# Altium schematic sheet nrf-adafruit bno055.SchDoc: Adafruit nRF52840 Bluefruit Feather Express Rev E
size 409 x 281 mm; SheetTotal: 1; Origin: Eagle; SheetNumber: 1; YEAR: YEAR; COMPANY: COMPANY; DRAWN: DRAWN; Date: 7/7/2025 6:48:38 PM; REV: REV; GateName_1: G$1; SymbolName_1: FRAME_A3; LibraryName: microbuilder; DeviceSetName: FRAME_A3; GateName_2: G$3; SymbolName_2: FRAME_DOCFIELD; DRG: DRG; o: o; N: N; C: C; ISSUE: ISSUE; FILE: FILE:; PAGE: PAGE:; CHECKED: CHECKED; DRGNO: >DRGNO
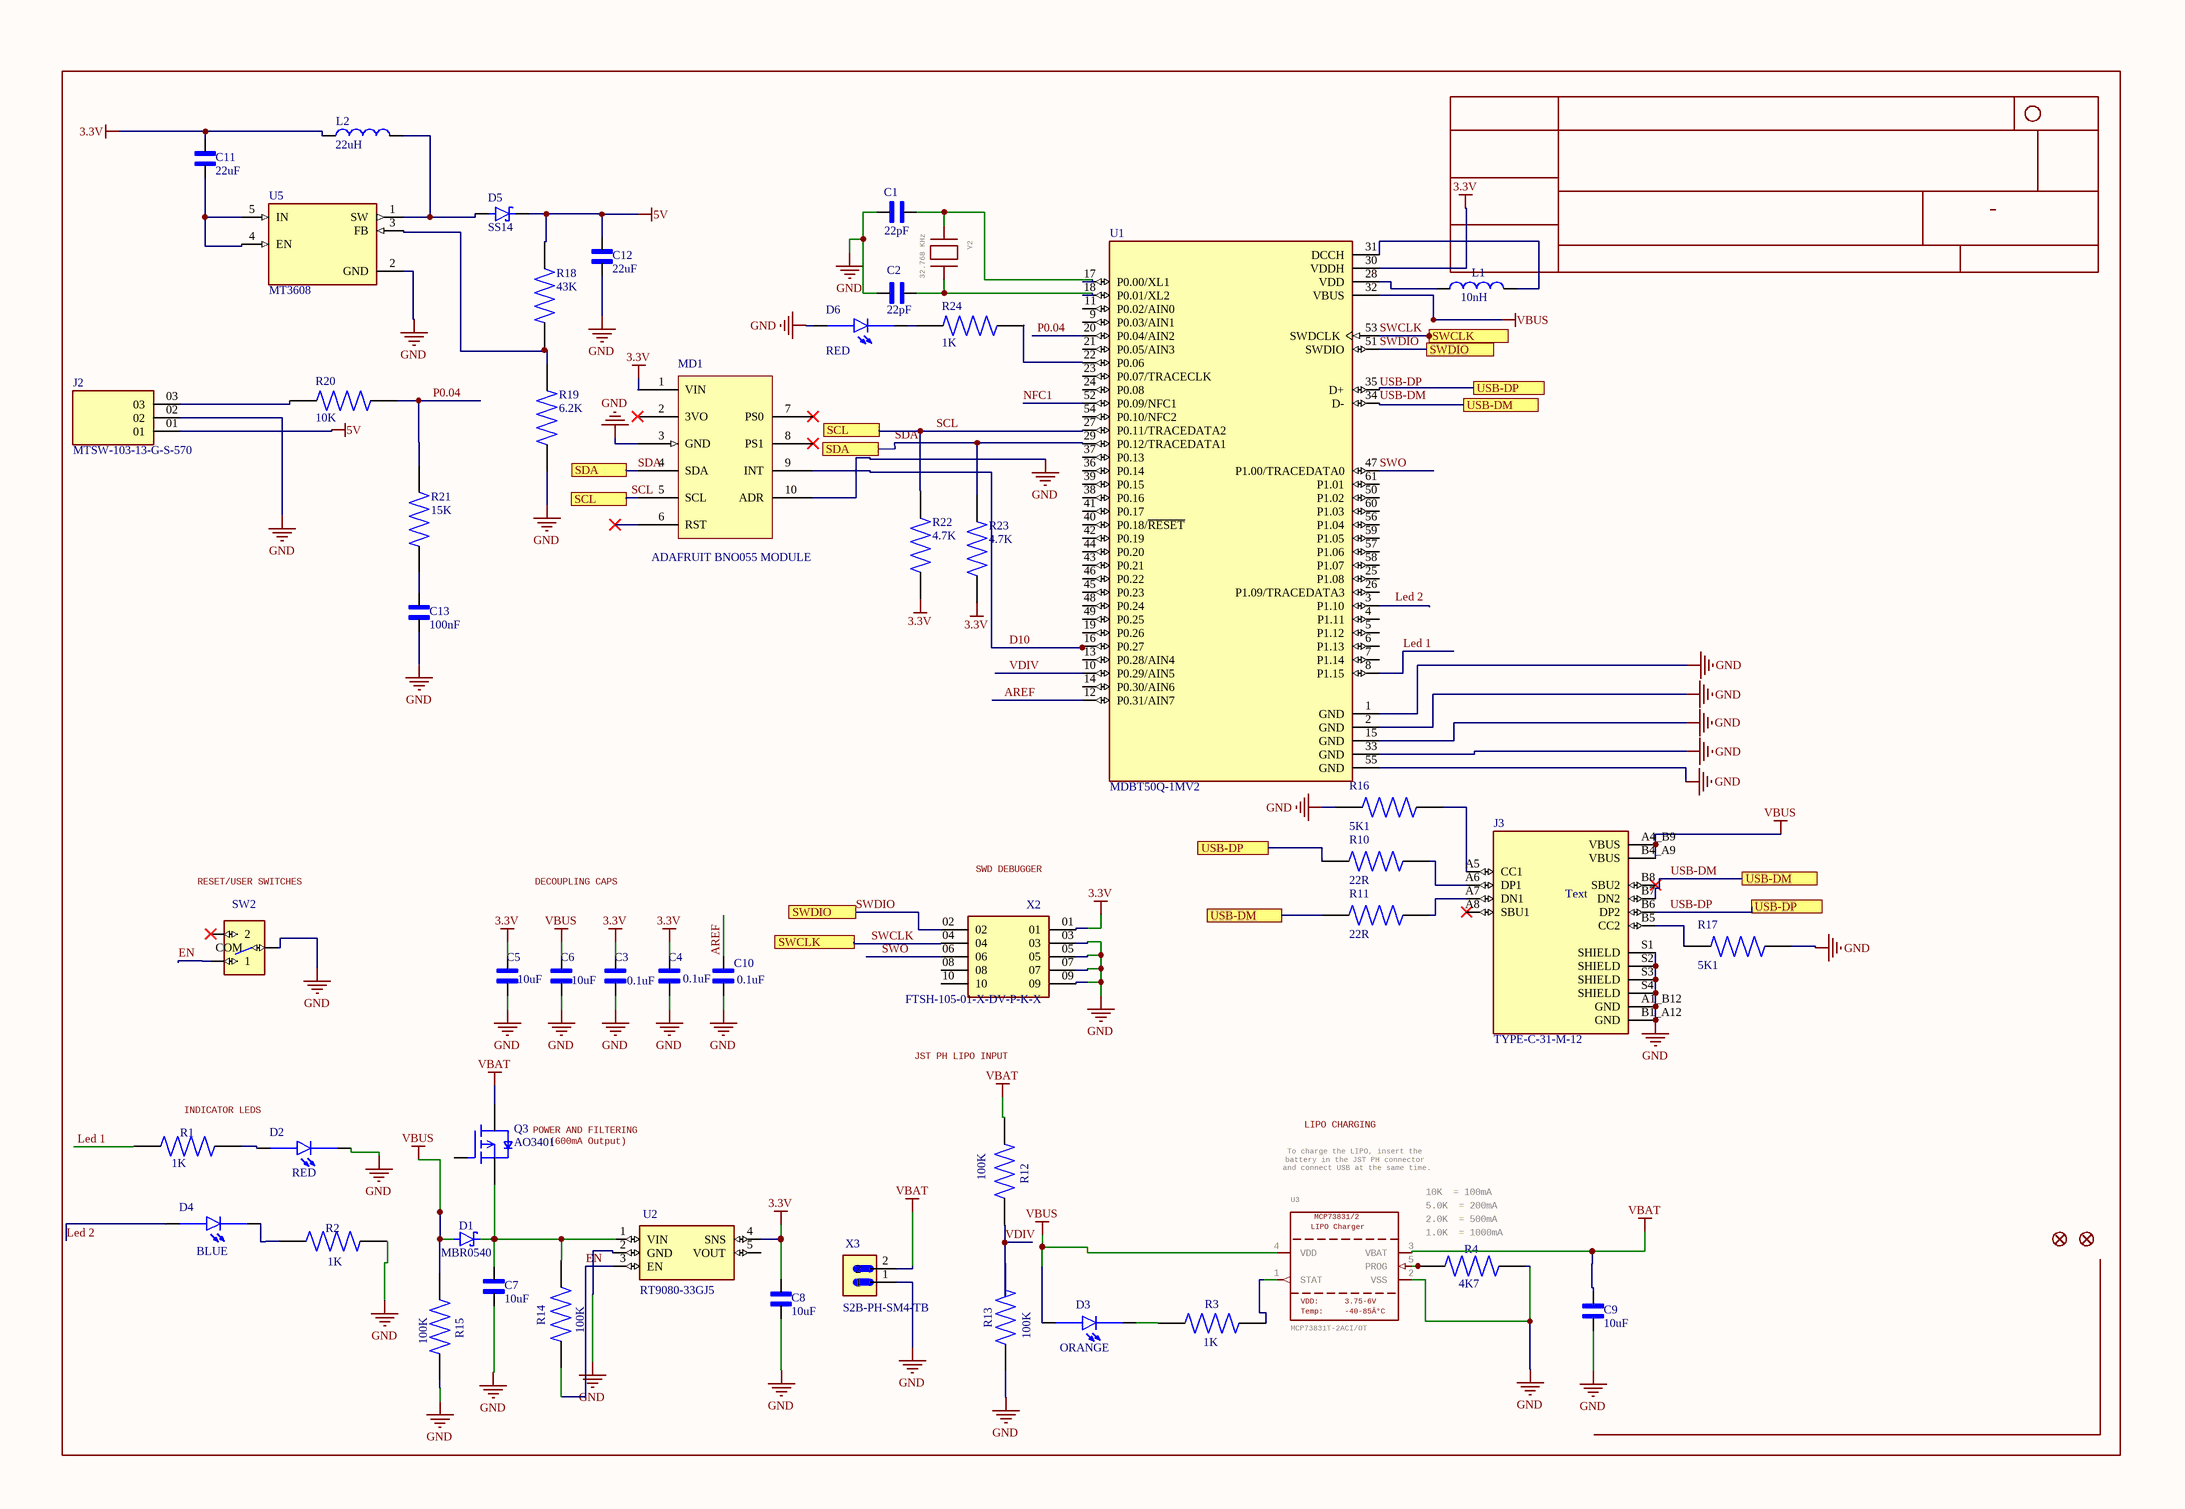
[diagram p0: nrf-adafruit bno055.SchDoc]

## Parts
C1  22pF  [CAPC1608X90]
C2  22pF  [CAPC1608X90]
C3  0.1uF  [CAPC1608X90N]
C4  0.1uF  [CAPC1608X90N]
C5  10uF  [CAPC2012X88N]
C6  10uF  [CAPC2012X88N]
C7  10uF  [CAPC2012X88N]
C8  10uF  [CAPC2012X88N]
C9  10uF  [CAPC2012X88N]
C10  0.1uF  [CAPC1608X90N]
C11  22uF  [CAPC3216X229N]
C12  22uF  [CAPC3216X229N]
C13  100nF  [CAPC1608X90N]
D1  MBR0540  [DIO_MBR0540-TP]
D2  RED  [LEDC2012X70N]
D3  ORANGE  [LEDC2012X70N]
D4  BLUE  [LEDC2012X70N]
D5  SS14  [SMA]
D6  RED  [LEDC2012X70N]
FID1  FIDUCIAL_1MM  [FIDUCIAL_1MM]  (value not drawn)
FID2  FIDUCIAL_1MM  [FIDUCIAL_1MM]  (value not drawn)
J2  MTSW-103-13-G-S-570  [SAMTEC_MTSW-103-13-G-S-570]
J3  TYPE-C-31-M-12  [HRO_TYPE-C-31-M-12]
L1  10nH  [INDC2015X152N]
L2  22uH  [INDC2012X145N]
MD1  Module BNO055  [PCBComponent_1]  (value not drawn)
Q3  AO3401  [SOT23-3]
R1  1K  [RES_ERJU03J5R6V]
R2  1K  [RES_ERJU03J5R6V]
R3  1K  [RES_ERJU03J5R6V]
R4  4K7  [RES_ERJU03J5R6V]
R10  22R  [RES_ERJU03J5R6V]
R11  22R  [RES_ERJU03J5R6V]
R12  100K  [RES_ERJU03J5R6V]
R13  100K  [RES_ERJU03J5R6V]
R14  100K  [RES_ERJU03J5R6V]
R15  100K  [RES_ERJU03J5R6V]
R16  5K1  [RES_ERJU03J5R6V]
R17  5K1  [RES_ERJU03J5R6V]
R18  43K  [RES_ERJU03J5R6V]
R19  6.2K  [RES_ERJU03J5R6V]
R20  10K  [RES_ERJU03J5R6V]
R21  15K  [RES_ERJU03J5R6V]
R22  4.7K  [RES_ERJU03J5R6V]
R23  4.7K  [RES_ERJU03J5R6V]
R24  1K  [RES_ERJU03J5R6V]
SW2  SK12D07VG4  [SK12D07VG4]  (value not drawn)
U1  MDBT50Q-1MV2  [XCVR_MDBT50Q-1MV2]
U2  RT9080-33GJ5  [SOT94P280X100-5N]
U3  MCP73831T-2ACI/OT  LIPOCharger: LIPO Charger  Temp: Temp:  VDD: VDD:  [SOT23-5]
U5  MT3608  [SOT95P280X145-6N]
X2  FTSH-105-01-X-DV-P-K-X  [SAMTEC_FTSH-105-01-X-DV-P-K-X]
X3  S2B-PH-SM4-TB  [JST_S2B-PH-SM4-TB]
Y2  32.768 KHz  [XTAL3215]

## Ports
SCL (see nrf[2B]), SCL (see nrf[3B]), SDA (see nrf[2B]), SDA (see nrf[3B]), SWCLK (see nrf[3C]), SWCLK (see nrf[4A]), SWDIO (see nrf[3C]), SWDIO (see nrf[4A]), USB-DM (see nrf[4C], nrf[5B]), USB-DM (see nrf[4C], nrf[5C]), USB-DM (see nrf[5B], nrf[5C]), USB-DP (see nrf[4C], nrf[5B]), USB-DP (see nrf[4C], nrf[5C]), USB-DP (see nrf[5B], nrf[5C])

## Nets
3.3V: C3.1 C4.1 C5.2 C8.2 C11.2 L2.1 MD1.1(VIN) R22.1 R23.1 U1.30(VDDH) U2.4(SNS) X2.01
5V: C12.2 D5.P2(C) J2.01 R18.2
GND: C1.2 C2.2 C3.2 C4.2 C5.1 C6.1 C7.1 C8.1 C9.1 C10.2 C12.1 C13.1 D2.C D6.A J2.02 J3.A1_B12(GND) J3.B1_A12(GND) J3.S1(SHIELD) J3.S2(SHIELD) J3.S3(SHIELD) J3.S4(SHIELD) MD1.3(GND) MD1.10(ADR) R2.2 R4.2 R13.1 R15.2 R16.1 R17.2 R19.1 SW2.COM U1.1(GND) U1.2(GND) U1.15(GND) U1.33(GND) U1.55(GND) U2.2(GND) U3.2(VSS) U5.2(GND) X2.03 X2.05 X2.07 X2.09 X3.1
VBAT: C9.2 Q3.3(D) R12.1 U3.3(VBAT) X3.2
VBUS: C6.2 D1.A D3.A J3.A4_B9(VBUS) J3.B4_A9(VBUS) R15.1 U1.32(VBUS) U3.4(VDD)
AREF: C10.1 U1.12(P0.31/AIN7)
D10: MD1.9(INT) U1.16(P0.27)
EN: R14.1 SW2.1 U2.3(EN)
Led 1: R1.1 U1.8(P1.15)
Led 2: D4.A
NFC1: U1.52(P0.09/NFC1)
P0.04: R20.2 R21.2 U1.20(P0.04/AIN2)
SCL: MD1.5(SCL) R22.2 U1.27(P0.11/TRACEDATA2) ; port SCL
SDA: MD1.4(SDA) R23.2 U1.29(P0.12/TRACEDATA1) ; port SDA
SWCLK: U1.53(SWDCLK) X2.04 ; port SWCLK
SWDIO: U1.51(SWDIO) X2.02 ; port SWDIO
SWO: U1.47(P1.00/TRACEDATA0) X2.06
USB-DM: J3.B7(DN2) R11.1 U1.34(D-) ; port USB-DM
USB-DP: J3.B6(DP2) R10.1 U1.35(D+) ; port USB-DP
VDIV: R12.2 R13.2 U1.10(P0.29/AIN5)
NetC1_1: C1.1 U1.17(P0.00/XL1) Y2.P$1
NetC2_1: C2.1 U1.18(P0.01/XL2) Y2.P$2
NetC7_2: C7.2 D1.C(K) Q3.2(S) R14.2 U2.1(VIN)
NetC11_1: C11.1 U5.4(EN) U5.5(IN)
NetC13_2: C13.2 R21.1
NetD2_A: D2.A R1.2
NetD3_C: D3.C R3.1
NetD4_C: D4.C R2.1
NetD5_P1: D5.P1(A) L2.2 U5.1(SW)
NetD6_C: D6.C R24.1
NetJ2_03: J2.03 R20.1
NetJ3_A5: J3.A5(CC1) R16.2
NetJ3_A6: J3.A6(DP1) R10.2
NetJ3_A7: J3.A7(DN1) R11.2
NetJ3_B5: J3.B5(CC2) R17.1
NetL1_1: L1.1 U1.28(VDD)
NetL1_2: L1.2 U1.31(DCCH)
NetR3_2: R3.2 U3.1(STAT)
NetR4_1: R4.1 U3.5(PROG)
NetR18_1: R18.1 R19.2 U5.3(FB)
NetR24_2: R24.2 U1.22(P0.06)

Not connected (* = marked no-connect by the designer): J3 A8(SBU1)* B8(SBU2)*; MD1 2(3VO)* 6(RST)* 7(PS0)* 8(PS1)*; Q3 1(G); SW2 2*; U1 3(P1.10) 4(P1.11) 5(P1.12) 6(P1.13) 7(P1.14) 9(P0.03/AIN1) 11(P0.02/AIN0) 13(P0.28/AIN4) 14(P0.30/AIN6) 19(P0.26) 21(P0.05/AIN3) 23(P0.07/TRACECLK) 24(P0.08) 25(P1.08) 26(P1.09/TRACEDATA3) 36(P0.14) 37(P0.13) 38(P0.16) 39(P0.15) 40(P0.18/~{RESET}) 41(P0.17) 42(P0.19) 43(P0.21) 44(P0.20) 45(P0.23) 46(P0.22) 48(P0.24) 49(P0.25) 50(P1.02) 54(P0.10/NFC2) 56(P1.04) 57(P1.06) 58(P1.07) 59(P1.05) 60(P1.03) 61(P1.01); U2 5(VOUT); X2 08 10

## Notes on the sheet
- (near SW2) RESET/USER SWITCHES
- DECOUPLING CAPS
- (near X2) SWD DEBUGGER
- (near J3) Text
- JST PH LIPO INPUT
- INDICATOR LEDS
- LIPO CHARGING
- (near Q3) POWER AND FILTERING
  (600mA Output)
- To charge the LIPO, insert the
  battery in the JST PH connector
  and connect USB at the same time.
- 10K  = 100mA
- 5.0K  = 200mA
- 2.0K  = 500mA
- 1.0K  = 1000mA
- Labels drawn without touching a wire or pin: Led 2
- (in symbol Component_1) ADAFRUIT BNO055 MODULE

## Library data of the parts
C1 C2 = CC0603JPNPO9BN220: 22 pF Â±5% 50V Ceramic Capacitor C0G, NP0 0603 (1608 Metric); MF: Yageo; SnapEDA_Link: https://www.snapeda.com/parts/CC0603JPNPO9BN220/Yageo/view-part/?ref=snap; Package: 0603 Yageo; Value: *; MP: CC0603JPNPO9BN220; Check_prices: https://www.snapeda.com/parts/CC0603JPNPO9BN220/Yageo/view-part/?ref=eda
C3 C4 C10 = C0603C104K4RAC: 0.1 ÂµF Â±10% 16V Ceramic Capacitor X7R 0603 (1608 Metric); MF: KEMET; SnapEDA_Link: https://www.snapeda.com/parts/C0603C104K4RAC/KEMET/view-part/?ref=snap; Package: 603-2 KEMET; Value: *; MP: C0603C104K4RAC; Check_prices: https://www.snapeda.com/parts/C0603C104K4RAC/KEMET/view-part/?ref=eda
C5-C9 = C0805C106K4PACTU: 10 ÂµF Â±10% 16V Ceramic Capacitor X5R 0805 (2012 Metric); MF: KEMET; SnapEDA_Link: https://www.snapeda.com/parts/C0805C106K4PACTU/KEMET/view-part/?ref=snap; Package: 0805 Kemet; Value: *; MP: C0805C106K4PACTU; Check_prices: https://www.snapeda.com/parts/C0805C106K4PACTU/KEMET/view-part/?ref=eda
C11 C12 = 12063D226MAT2A: 22 µF ±20% 25V Ceramic Capacitor X5R 1206 (3216 Metric); MF: Kyocera; SnapEDA_Link: https://www.snapeda.com/parts/12063D226MAT2A/Kyocera/view-part/?ref=snap; Package: None; Value: *; MP: 12063D226MAT2A; Check_prices: https://www.snapeda.com/parts/12063D226MAT2A/Kyocera/view-part/?ref=eda
C13 = 06035C104K4T2A: Capacitor MLCC 0603 100nF 50V | AVX 06035C104K4T2A; SnapEDA_Link: https://www.snapeda.com/parts/06035C104K4T2A/AVX/view-part/?ref=snap; Package: 1608 AVX; Value: *; MF: AVX; MP: 06035C104K4T2A; Check_prices: https://www.snapeda.com/parts/06035C104K4T2A/AVX/view-part/?ref=eda
D1 = MBR0540-TP: Diode Schottky 40 V 500mA Surface Mount SOD-123; MF: Micro Commercial; SnapEDA_Link: https://www.snapeda.com/parts/MBR0540-TP/Micro+Commercial+Components/view-part/?ref=snap; Package: SOD-123 Multicomp; Value: *; MP: MBR0540-TP; Check_prices: https://www.snapeda.com/parts/MBR0540-TP/Micro+Commercial+Components/view-part/?ref=eda
D2-D4 D6 = 597-3305-607F: LED Uni-Color Green 4-Pin Chip 0805 T/R; Availability: Unavailable; Value: *; Price: None; MP: 597-3305-607F; Package: None
D5 = SS14: Diode Schottky 40 V 1A Surface Mount DO-214AC (SMA); MF: ON; SnapEDA_Link: https://www.snapeda.com/parts/SS14/Onsemi/view-part/?ref=snap; Package: SMA-2 ON Semiconductor; Value: *; MP: SS14; Check_prices: https://www.snapeda.com/parts/SS14/Onsemi/view-part/?ref=eda
FID1 FID2 = FIDUCIAL_1MM: Fiducial Alignment Points   Various fiducial points for machine vision alignment.; GateName_1: G$1; DeviceName: _1MM; BOM: EXCLUDE; SymbolName_1: FIDUCIAL; LibraryName: microbuilder; DeviceSetName: FIDUCIAL
J2 = MTSW-103-13-G-S-570: Connector Header Through Hole 3 position 0.100 (2.54mm); MF: Samtec; SnapEDA_Link: https://www.snapeda.com/parts/MTSW-103-13-G-S-570/Samtec/view-part/?ref=snap; Package: None; Value: *; MP: MTSW-103-13-G-S-570; Check_prices: https://www.snapeda.com/parts/MTSW-103-13-G-S-570/Samtec/view-part/?ref=eda
J3 = TYPE-C-31-M-12: USB Connectors 24 Receptacle 1 8.94*7.3mm RoHS; MF: HRO Electronics Co., Ltd.; SnapEDA_Link: https://www.snapeda.com/parts/TYPE-C-31-M-12/HRO+Electronics+Co.%252C+Ltd./view-part/?ref=snap; Package: Package; Value: *; MP: TYPE-C-31-M-12; Check_prices: https://www.snapeda.com/parts/TYPE-C-31-M-12/HRO+Electronics+Co.%252C+Ltd./view-part/?ref=eda
L1 = LQW2BAS10NG00L: FIXED IND 10NH 600MA 100 MOHM; Package: None; Price: None; Value: *; MP: LQW2BAS10NG00L; Availability: Unavailable
L2 = LQM21DH220M70L: Inductor with Inductance: 22uH Tol. +/-20%, Package: 0805 (2012); MF: Murata; SnapEDA_Link: https://www.snapeda.com/parts/LQM21DH220M70L/Murata/view-part/?ref=snap; Package: 2012 Bourns; Value: *; MP: LQM21DH220M70L; Check_prices: https://www.snapeda.com/parts/LQM21DH220M70L/Murata/view-part/?ref=eda
MD1 = Component_1: Module 9 DOF BNO055 by Adafruit
Q3 = AO3401: P-Channel 30 V 4A (Ta) 1.4W (Ta) Surface Mount SOT-23-3; MF: Alpha & Omega Semiconductor; SnapEDA_Link: https://www.snapeda.com/parts/AO3401/Alpha/view-part/?ref=snap; Package: SOT-23-3 Alpha &amp; Omega Semiconductor; Value: *; MP: AO3401; Check_prices: https://www.snapeda.com/parts/AO3401/Alpha/view-part/?ref=eda
R1-R4 R10-R24 = ERJU03J5R6V: 0201 anti-sulfurated resistor 0603 Anti-Sulfurated; MF: Panasonic; MP: ERJ-U03J5R6V; SnapEDA_Link: https://www.snapeda.com/parts/ERJ-U03J5R6V/Panasonic/view-part/?ref=snap; Package: 1608-2 Panasonic; Value: *; Check_prices: https://www.snapeda.com/parts/ERJ-U03J5R6V/Panasonic/view-part/?ref=eda
SW2 = SK12D07VG4: Switch Slide ON ON SPDT Side Slide 0.3A 30VDC PC Pins Bracket Mount/Through Hole Bulk; MF: C&K; SnapEDA_Link: https://www.snapeda.com/parts/SK12D07VG4/C%2526K/view-part/?ref=snap; Package: None; Value: *; MP: SK12D07VG4; Check_prices: https://www.snapeda.com/parts/SK12D07VG4/C%2526K/view-part/?ref=eda
U1 = MDBT50Q-1MV2: 802.15.4, Bluetooth Bluetooth v5.4, ZigbeeÂ® Transceiver Module 2.36GHz ~ 2.5GHz Integrated, Chip Surface Mount; MF: Raytac Corporation; SnapEDA_Link: https://www.snapeda.com/parts/MDBT50Q-1MV2/Raytac+Corporation/view-part/?ref=snap; Package: SMD-61 Raytac Corporation; Value: *; MP: MDBT50Q-1MV2; Check_prices: https://www.snapeda.com/parts/MDBT50Q-1MV2/Raytac+Corporation/view-part/?ref=eda
U2 = RT9080-33GJ5: Linear Voltage Regulator IC Positive Fixed 1 Output 600mA TSOT-23-5; MF: Richtek USA; SnapEDA_Link: https://www.snapeda.com/parts/RT9080-33GJ5/Richtek/view-part/?ref=snap; Package: TSOT-23 Richtek; Value: *; MP: RT9080-33GJ5; Check_prices: https://www.snapeda.com/parts/RT9080-33GJ5/Richtek/view-part/?ref=eda
U3 = MCP73831/2: MCP73831/2 LIPO Charger    VDD: 3.75 - 6V  Temp -40 - 85Â°C  Programmable Charge Rate: 15-500mA       NOTE: STAT is a tri-state logic output on the MCP73831 and an open-drain output on the MCP73832.   SOT23-5 with 4.2V output and tri-state logic on STAT = MCP73831T-2ACI/OT; GateName_1: G$1; SymbolName_1: MCP73831/2; LibraryName: microbuilder; DeviceSetName: MCP73831/2; MCP73831/2: MCP73831/2; -40-85Â°C: -40-85Â°C; 3.75-6V: 3.75-6V; JLC_ROTATION: 0; LCSC: C424093
U5 = MT3608: High Efficiency 1.2MHz2A Step Up Converter; MF: Aerosemi Technology Co., Ltd; Price: None; Availability: Not in stock; Package: Package; MP: MT3608; Value: *; SnapEDA_Link: https://www.snapeda.com/parts/MT3608/Aerosemi+Technology+Co.%252C+Ltd/view-part/?ref=snap; Check_prices: https://www.snapeda.com/parts/MT3608/Aerosemi+Technology+Co.%252C+Ltd/view-part/?ref=eda
X2 = FTSH-105-01-X-DV-P-K-X: MF: {'manufacturer': u'Samtec Inc.'}; Package: None; Price: None; Value: *; MP: FTSH-105-01-X-DV-P-K-X; Availability: Unavailable
X3 = S2B-PH-SM4-TB: Connector Header Surface Mount, Right Angle 2 position 0.079 (2.00mm); MF: JST Sales; SnapEDA_Link: https://www.snapeda.com/parts/S2B-PH-SM4-TB/JST/view-part/?ref=snap; Package: None; Value: *; MP: S2B-PH-SM4-TB; Check_prices: https://www.snapeda.com/parts/S2B-PH-SM4-TB/JST/view-part/?ref=eda
Y2 = XTAL-3.2X1.5: Low cost SMT crystals, no capacitors included    http://www.ladyada.net/library/eagle; GateName_1: G$1; SymbolName_1: XTAL; DeviceName: -3.2X1.5; LibraryName: adafruit2; DeviceSetName: XTAL